# Altium project Digital Debugger.PrjPcb
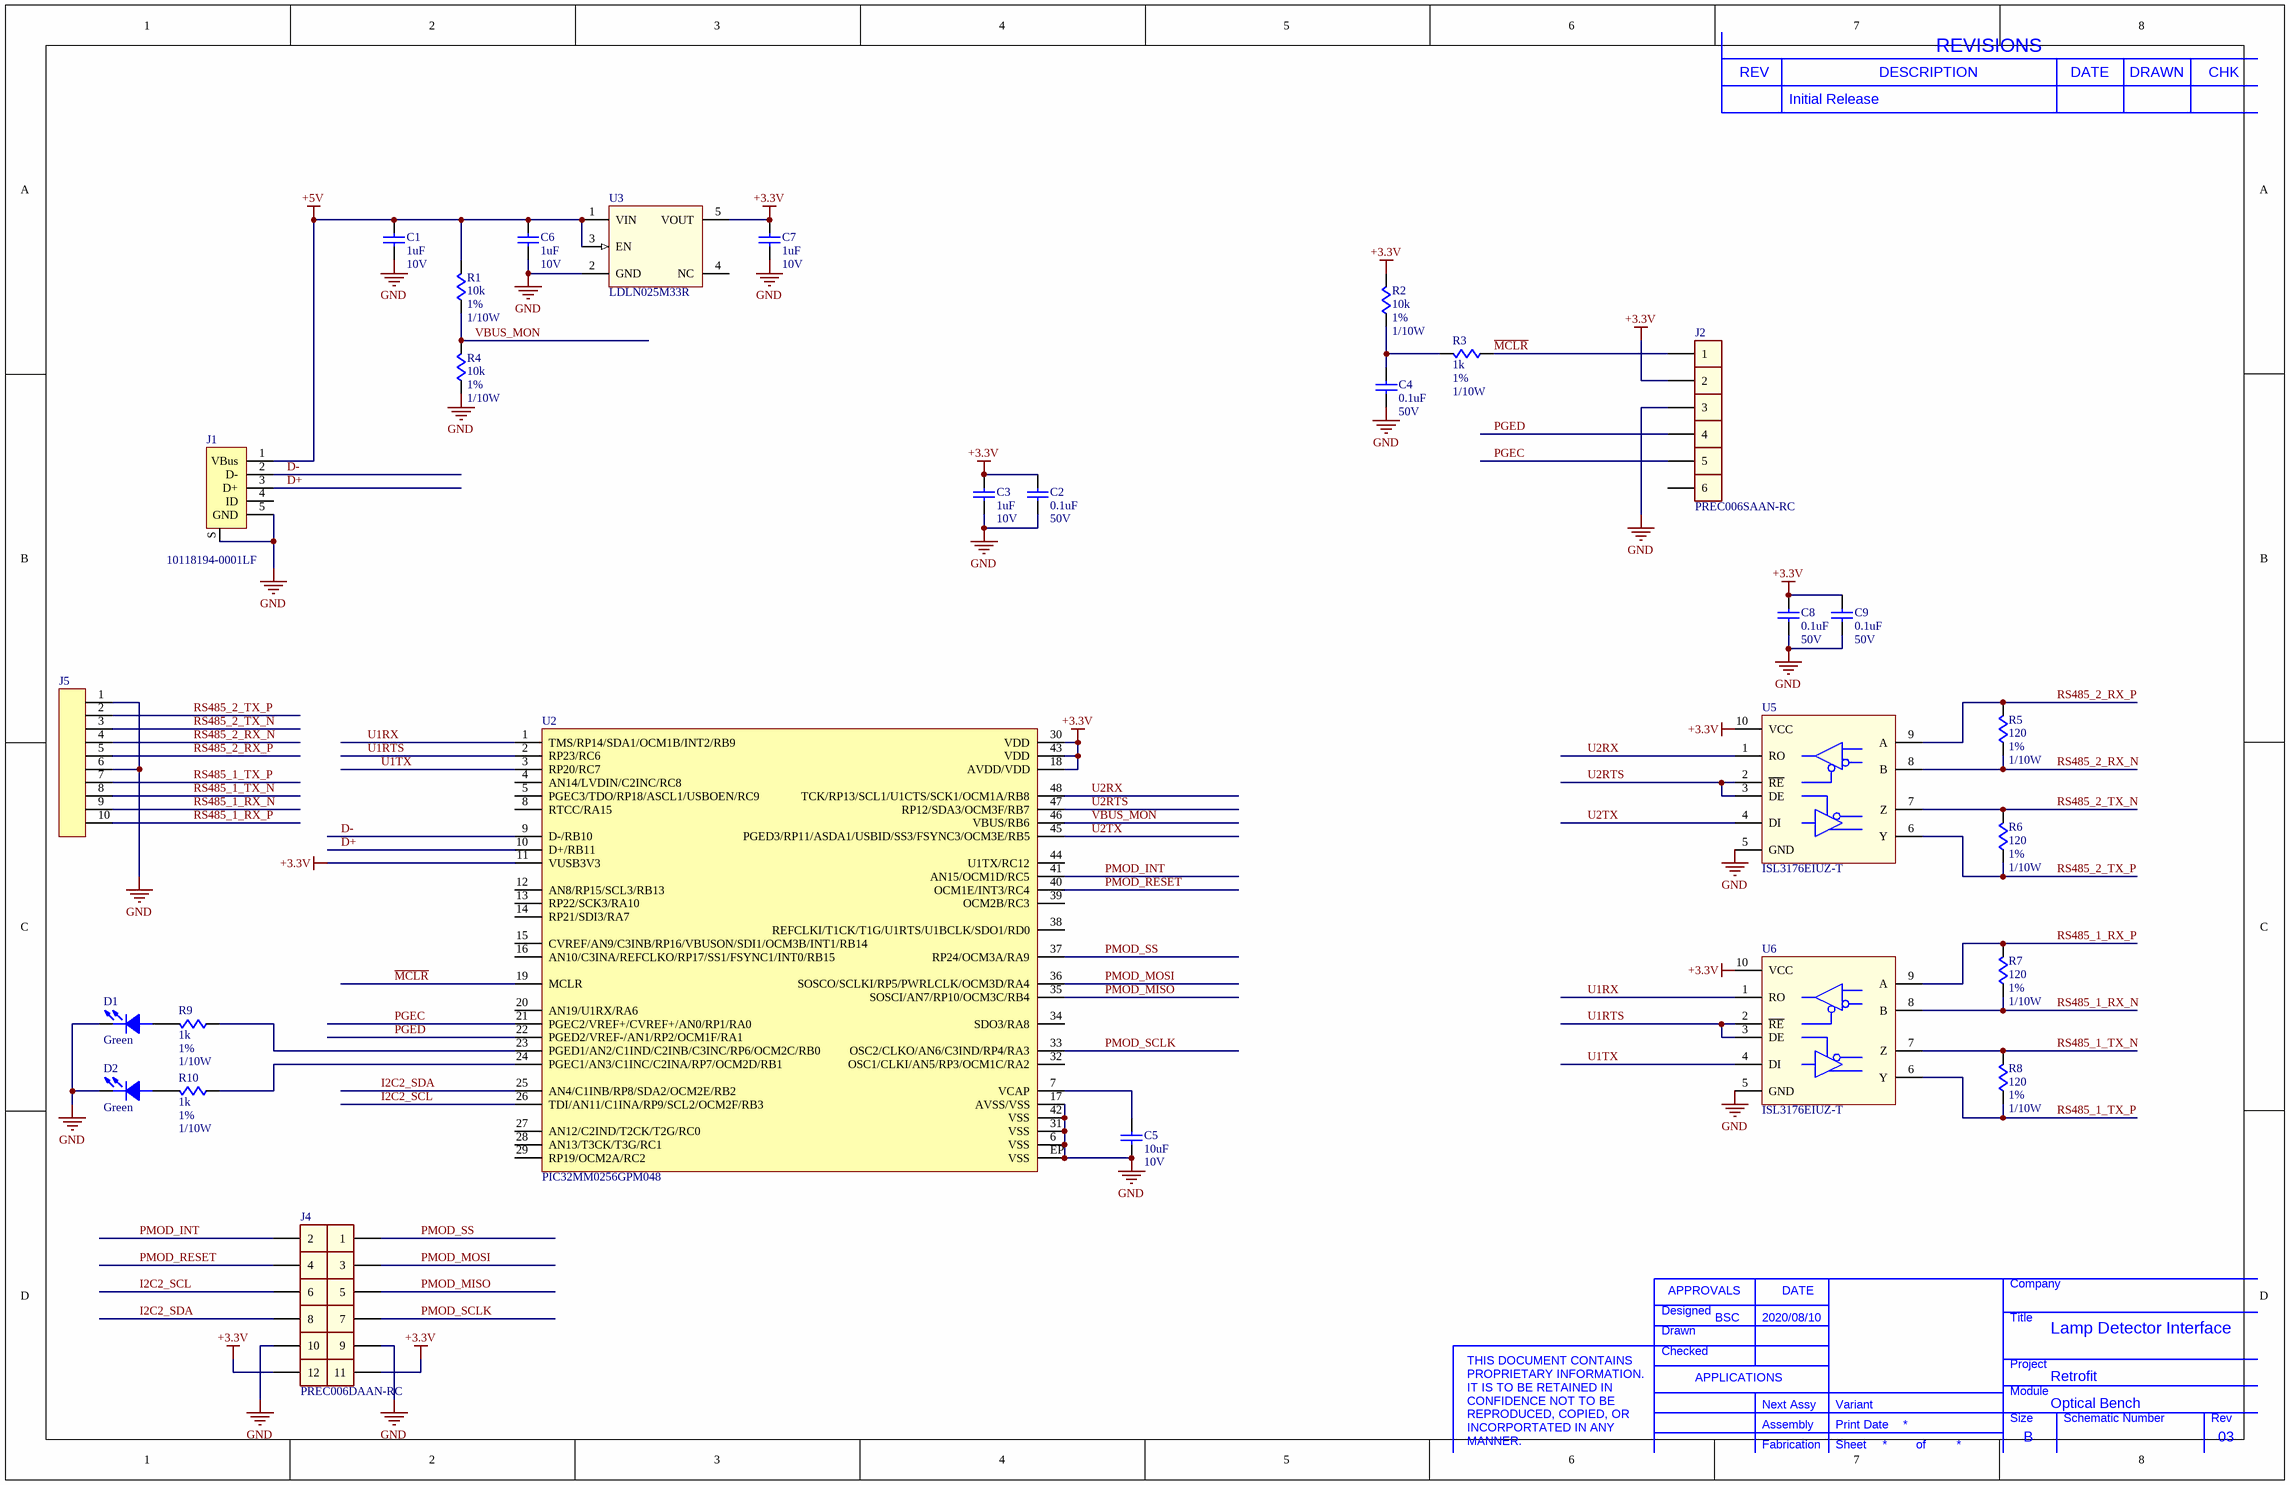
[diagram p0: Sheet1.SchDoc]
AssyRev: 03; DesignDate: 2020/08/10; Designed: BSC; FabRev: 03; Module: Optical Bench; Project: Retrofit; Title1: Lamp Detector Interface
1 sheet, 29 parts. Net scope: global (net labels, ports and power ports of the same name join across sheets).
Board file: Digital Debugger.PcbDoc

## Sheet Sheet1.SchDoc
size Tabloid

### Parts
C1  1uF  Voltage: 10V  [CAP_0603]
C2  0.1uF  Voltage: 50V  [CAP_0603]
C3  1uF  Voltage: 10V  [CAP_0603]
C4  0.1uF  Voltage: 50V  [CAP_0603]
C5  10uF  Voltage: 10V  [CAP_0603]
C6  1uF  Voltage: 10V  [CAP_0603]
C7  1uF  Voltage: 10V  [CAP_0603]
C8  0.1uF  Voltage: 50V  [CAP_0603]
C9  0.1uF  Voltage: 50V  [CAP_0603]
D1  Green  [DIO_0603]
D2  Green  [DIO_0603]
J1  10118194-0001LF  [CONN_USB_MICRO_B_RA]
J2  PREC006SAAN-RC  [CONN_Male_1x6]
J4  PREC006DAAN-RC  [CONN_Male_2x6z]
J5  PREC010SAAN-RC  [CONN_Male_1x10]  (value not drawn)
R1  10k  Tolerance: 1%  Power: 1/10W  [RES_0603]
R2  10k  Tolerance: 1%  Power: 1/10W  [RES_0603]
R3  1k  Tolerance: 1%  Power: 1/10W  [RES_0603]
R4  10k  Tolerance: 1%  Power: 1/10W  [RES_0603]
R5  120  Tolerance: 1%  Power: 1/10W  [RES_0603]
R6  120  Tolerance: 1%  Power: 1/10W  [RES_0603]
R7  120  Tolerance: 1%  Power: 1/10W  [RES_0603]
R8  120  Tolerance: 1%  Power: 1/10W  [RES_0603]
R9  1k  Tolerance: 1%  Power: 1/10W  [RES_0603]
R10  1k  Tolerance: 1%  Power: 1/10W  [RES_0603]
U2  PIC32MM0256GPM048  [UQFN-48EP]
U3  LDLN025M33R  [SOT23-5]
U5  ISL3176EIUZ-T  [MSOP-10]
U6  ISL3176EIUZ-T  [MSOP-10]

### Nets
+3.3V: C2.1 C3.1 C7.1 C8.1 C9.1 J2.2 J4.11 J4.12 R2.2 U2.11(VUSB3V3) U2.18(AVDD/VDD) U2.30(VDD) U2.43(VDD) U3.5(VOUT) U5.10(VCC) U6.10(VCC)
+5V: C1.1 C6.1 J1.1(VBus) R1.2 U3.1(VIN) U3.3(EN)
GND: C1.2 C2.2 C3.2 C4.2 C5.2 C6.2 C7.2 C8.2 C9.2 D1.K D2.K J1.5(GND) J1.S J2.3 J4.9 J4.10 J5.1 J5.6 R4.1 U2.6(VSS) U2.17(AVSS/VSS) U2.31(VSS) U2.42(VSS) U2.EP(VSS) U3.2(GND) U5.5(GND) U6.5(GND)
D+: J1.3(D+) U2.10(D+/RB11)
D-: J1.2(D-) U2.9(D-/RB10)
I2C2_SCL: J4.6 U2.26(TDI/AN11/C1INA/RP9/SCL2/OCM2F/RB3)
I2C2_SDA: J4.8 U2.25(AN4/C1INB/RP8/SDA2/OCM2E/RB2)
~{MCLR}: J2.1 R3.1 U2.19(MCLR)
PGEC: J2.5 U2.21(PGEC2/VREF+/CVREF+/AN0/RP1/RA0)
PGED: J2.4 U2.22(PGED2/VREF-/AN1/RP2/OCM1F/RA1)
PMOD_INT: J4.2 U2.41(AN15/OCM1D/RC5)
PMOD_MISO: J4.5 U2.35(SOSCI/AN7/RP10/OCM3C/RB4)
PMOD_MOSI: J4.3 U2.36(SOSCO/SCLKI/RP5/PWRLCLK/OCM3D/RA4)
PMOD_RESET: J4.4 U2.40(OCM1E/INT3/RC4)
PMOD_SCLK: J4.7 U2.33(OSC2/CLKO/AN6/C3IND/RP4/RA3)
PMOD_SS: J4.1 U2.37(RP24/OCM3A/RA9)
RS485_1_RX_N: J5.9 R7.1 U6.8(B)
RS485_1_RX_P: J5.10 R7.2 U6.9(A)
RS485_1_TX_N: J5.8 R8.2 U6.7(Z)
RS485_1_TX_P: J5.7 R8.1 U6.6(Y)
RS485_2_RX_N: J5.4 R5.1 U5.8(B)
RS485_2_RX_P: J5.5 R5.2 U5.9(A)
RS485_2_TX_N: J5.3 R6.2 U5.7(Z)
RS485_2_TX_P: J5.2 R6.1 U5.6(Y)
U1RTS: U2.2(RP23/RC6) U6.2(~{RE}) U6.3(DE)
U1RX: U2.1(TMS/RP14/SDA1/OCM1B/INT2/RB9) U6.1(RO)
U1TX: U2.3(RP20/RC7) U6.4(DI)
U2RTS: U2.47(RP12/SDA3/OCM3F/RB7) U5.2(~{RE}) U5.3(DE)
U2RX: U2.48(TCK/RP13/SCL1/U1CTS/SCK1/OCM1A/RB8) U5.1(RO)
U2TX: U2.45(PGED3/RP11/ASDA1/USBID/SS3/FSYNC3/OCM3E/RB5) U5.4(DI)
VBUS_MON: R1.1 R4.2 U2.46(VBUS/RB6)
NetC4_1: C4.1 R2.1 R3.2
NetC5_1: C5.1 U2.7(VCAP)
NetD1_A: D1.A R9.2
NetD2_A: D2.A R10.2
NetR9_1: R9.1 U2.23(PGED1/AN2/C1IND/C2INB/C3INC/RP6/OCM2C/RB0)
NetR10_1: R10.1 U2.24(PGEC1/AN3/C1INC/C2INA/RP7/OCM2D/RB1)

Not connected (* = marked no-connect by the designer): J1 4(ID); J2 6; U2 4(AN14/LVDIN/C2INC/RC8) 5(PGEC3/TDO/RP18/ASCL1/USBOEN/RC9) 8(RTCC/RA15) 12(AN8/RP15/SCL3/RB13) 13(RP22/SCK3/RA10) 14(RP21/SDI3/RA7) 15(CVREF/AN9/C3INB/RP16/VBUSON/SDI1/OCM3B/INT1/RB14) 16(AN10/C3INA/REFCLKO/RP17/SS1/FSYNC1/INT0/RB15) 20(AN19/U1RX/RA6) 27(AN12/C2IND/T2CK/T2G/RC0) 28(AN13/T3CK/T3G/RC1) 29(RP19/OCM2A/RC2) 32(OSC1/CLKI/AN5/RP3/OCM1C/RA2) 34(SDO3/RA8) 38(REFCLKI/T1CK/T1G/U1RTS/U1BCLK/SDO1/RD0) 39(OCM2B/RC3) 44(U1TX/RC12); U3 4(NC)

### Notes on the sheet
- REV
- Initial Release
- DESCRIPTION
- REVISIONS
- DATE
- DRAWN
- CHK
- APPROVALS
- Company
- Checked
- Drawn
- Designed
- Title
- Project
- APPLICATIONS
- Assembly
- Next Assy
- Print Date
- Variant
- Size
- Module
- Schematic Number
- Rev
- THIS DOCUMENT CONTAINS PROPRIETARY INFORMATION.  IT IS TO BE RETAINED IN CONFIDENCE NOT TO BE REPRODUCED, COPIED, OR INCORPORTATED IN ANY MANNER.
- Fabrication
- Sheet
- of
- B

### Library data of the parts
C1 C3 C6 C7 = 2: Cap Cer 1uF 10V 10% X5R 0603; Part Number: 2; Manufacturer 1: Kemet; Manufacturer Part Number 1: C0603C105K8PACTU; Internal PN: 210-000002; Cat: Capacitors; Type: Ceramic; Tolerance: 10%; Other: X5R; Manufacturer 2: Yageo; Manufacturer Part Number 2: CC0603KRX5R6BB105; Manufacturer 3: N/A; Manufacturer 4: N/A
C2 C4 C8 C9 = 8: Cap Cer 0.1uF 50V 10% X7R 0603; Part Number: 8; Manufacturer 1: Samsung Electro-Mechanics; Manufacturer Part Number 1: CL10B104KB8NNNL; Internal PN: 210-000008; Cat: Capacitors; Type: Ceramic; Tolerance: 10%; Other: X7R; Manufacturer 2: Yageo; Manufacturer Part Number 2: CC0603KPX7R9BB104; Manufacturer 3: N/A; Manufacturer 4: N/A
C5 = 11: Cap Cer 10uF 10V 10% X5R 0603; Part Number: 11; Manufacturer 1: Samsung Electro-Mechanics; Manufacturer Part Number 1: CL10A106KP8NNNC; Internal PN: 210-000011; Cat: Capacitors; Type: Ceramic; Tolerance: 10%; Other: X5R; Manufacturer 2: Yageo; Manufacturer Part Number 2: CC0603KRX5R6BB106; Manufacturer 3: N/A; Manufacturer 4: N/A
D1 D2 = 13: Dio LED Green 2V 0603; Part Number: 13; Manufacturer 1: Wurth Electronics; Manufacturer Part Number 1: 150060VS55040; Internal PN: 275-000013; Cat: Diodes; Type: LED; Voltage: 2V; Manufacturer 2: N/A; Manufacturer 3: N/A; Manufacturer 4: N/A
J1 = 67: Conn Receptacle 10118194-0001LF 0.65mm USB Micro B RA; Part Number: 67; Manufacturer 1: Amphenol; Internal PN: 300-000067; Cat: Connectors; Type: Receptacle; Manufacturer Part Number 1: 10118194-0001LF; Manufacturer 2: N/A; Manufacturer 3: N/A; Manufacturer 4: N/A
J2 = 236: Conn HDR PREC006SAAN-RC 0.1" 3A Male 1x6; Part Number: 236; Internal PN: 300-000236; Cat: Connectors; Type: Header; Current: 3A; Manufacturer Part Number 1: PREC006SAAN-RC; Manufacturer 2: N/A; Manufacturer 3: N/A; Manufacturer 4: N/A
J4 = 239: Conn HDR PREC006DAAN-RC 0.1" 3A Male 2x6z; Part Number: 239; Manufacturer 1: Sullins Connector Solutions; Internal PN: 300-000239; Cat: Connectors; Type: Header; Current: 3A; Manufacturer Part Number 1: PREC006DAAN-RC; Manufacturer 2: N/A; Manufacturer 3: N/A; Manufacturer 4: N/A
J5 = 238: Conn HDR PREC010SAAN-RC 0.1" 3A Male 1x10; Part Number: 238; Manufacturer 1: Sullins Connector Solutions; Internal PN: 300-000238; Cat: Connectors; Type: Header; Current: 3A; Manufacturer Part Number 1: PREC010SAAN-RC; Manufacturer 2: N/A; Manufacturer 3: N/A; Manufacturer 4: N/A
R1 R2 R4 = 27: Res Thick 10k 75V 1/10W 1% 0603; Part Number: 27; Manufacturer 1: Yageo; Manufacturer Part Number 1: RC0603FR-0710KL; Internal PN: 195-000027; Cat: Resistors; Type: Thick Film; Voltage: 75V; Manufacturer 2: Stackpole Electronics; Manufacturer 3: Bourns; Manufacturer 4: N/A
R3 R9 R10 = 23: Res Thick 1k 75V 1/10W 1% 0603; Part Number: 23; Manufacturer 1: Yageo; Manufacturer Part Number 1: RC0603FR-071KL; Internal PN: 195-000023; Cat: Resistors; Type: Thick Film; Voltage: 75V; Manufacturer 2: Stackpole Electronics; Manufacturer 3: Bourns; Manufacturer 4: N/A
R5-R8 = 21: Res Thick 120 75V 1/10W 1% 0603; Part Number: 21; Manufacturer 1: Yageo; Manufacturer Part Number 1: RC0603FR-07120RL; Internal PN: 195-000021; Cat: Resistors; Type: Thick Film; Voltage: 75V; Manufacturer 2: Stackpole Electronics; Manufacturer 3: Bourns; Manufacturer 4: N/A
U2 = 234: IC MCU PIC32MM0256GPM048 2-3.6V UQFN-48EP; Part Number: 234; Manufacturer 1: Microchip; Internal PN: 200-000234; Cat: Integrated Circuits; Type: Microcontroller; Voltage: 2-3.6V; Manufacturer Part Number 1: PIC32MM0256GPM048; Manufacturer 2: N/A; Manufacturer 3: N/A; Manufacturer 4: N/A
U3 = 206: IC Reg LDO LDLN025M33R 250mA 3.3V OUT SOT23-5; Part Number: 206; Manufacturer 1: ST Microelectronics; Internal PN: 200-000206; Cat: Integrated Circuits; Type: Regulator LDO; Current: 250mA; Other: 3.3V OUT; Manufacturer Part Number 1: LDLN025M33R; Manufacturer 2: N/A; Manufacturer 3: N/A; Manufacturer 4: N/A
U5 U6 = 205: IC Comm ISL3176EIUZ-T 3-3.6V RS422/RS485 FULL DUPLEX MSOP-10; Part Number: 205; Manufacturer 1: Renesas; Internal PN: 200-000205; Cat: Integrated Circuits; Type: Communication; Voltage: 3-3.6V; Other: RS422/RS485; Circuits: FULL DUPLEX; Manufacturer Part Number 1: ISL3176EIUZ-T; Manufacturer 2: N/A; Manufacturer 3: N/A; Manufacturer 4: N/A